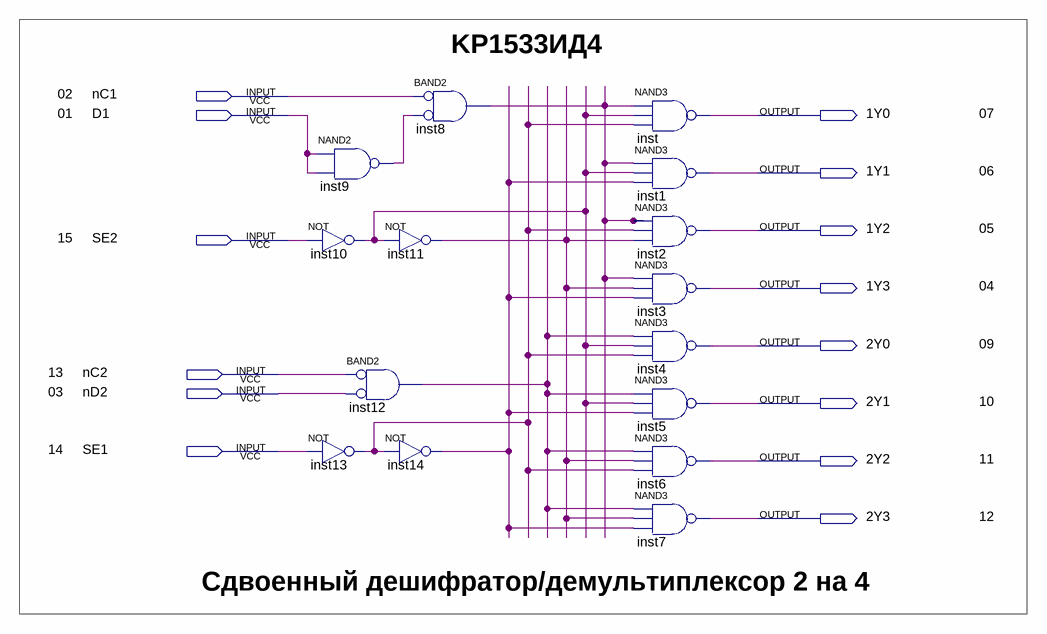
[diagram p0: schematic sheet]
// Quartus schematic KP1533ID4.bdf as structural Verilog: 15 symbols, 14 pins
module KP1533ID4 (
  input  nC1,
  input  D1,
  input  SE2,
  input  nC2,
  input  nD2,
  input  SE1,
  output \1Y0 ,
  output \1Y1 ,
  output \1Y2 ,
  output \1Y3 ,
  output \2Y0 ,
  output \2Y1 ,
  output \2Y2 ,
  output \2Y3 
);

  wire inst8_out, inst9_out, inst10_out, inst11_out, inst12_out, inst13_out, inst14_out;

  not inst10 (inst10_out, SE2);
  not inst13 (inst13_out, SE1);
  nand inst9 (inst9_out, D1, D1);
  not inst11 (inst11_out, inst10_out);
  and inst12 (inst12_out, ~nC2, ~nD2);  // BAND2
  not inst14 (inst14_out, inst13_out);
  and inst8 (inst8_out, ~nC1, ~inst9_out);  // BAND2
  nand inst (\1Y0 , inst8_out, inst10_out, inst13_out);
  nand inst1 (\1Y1 , inst8_out, inst10_out, inst14_out);
  nand inst2 (\1Y2 , inst8_out, inst13_out, inst11_out);
  nand inst3 (\1Y3 , inst8_out, inst11_out, inst14_out);
  nand inst4 (\2Y0 , inst12_out, inst10_out, inst13_out);
  nand inst5 (\2Y1 , inst12_out, inst10_out, inst14_out);
  nand inst6 (\2Y2 , inst12_out, inst11_out, inst13_out);
  nand inst7 (\2Y3 , inst12_out, inst11_out, inst14_out);

  // Notes on the sheet:
  //   KP1533ИД4
  //   02
  //   01
  //   07
  //   06
  //   05
  //   15
  //   04
  //   09
  //   13
  //   03
  //   10
  //   14
  //   11
  //   12
  //   Сдвоенный дешифратор/демультиплексор 2 на 4
endmodule
